# EAGLE schematic fpc_cable_all (EAGLE 9.6.2)
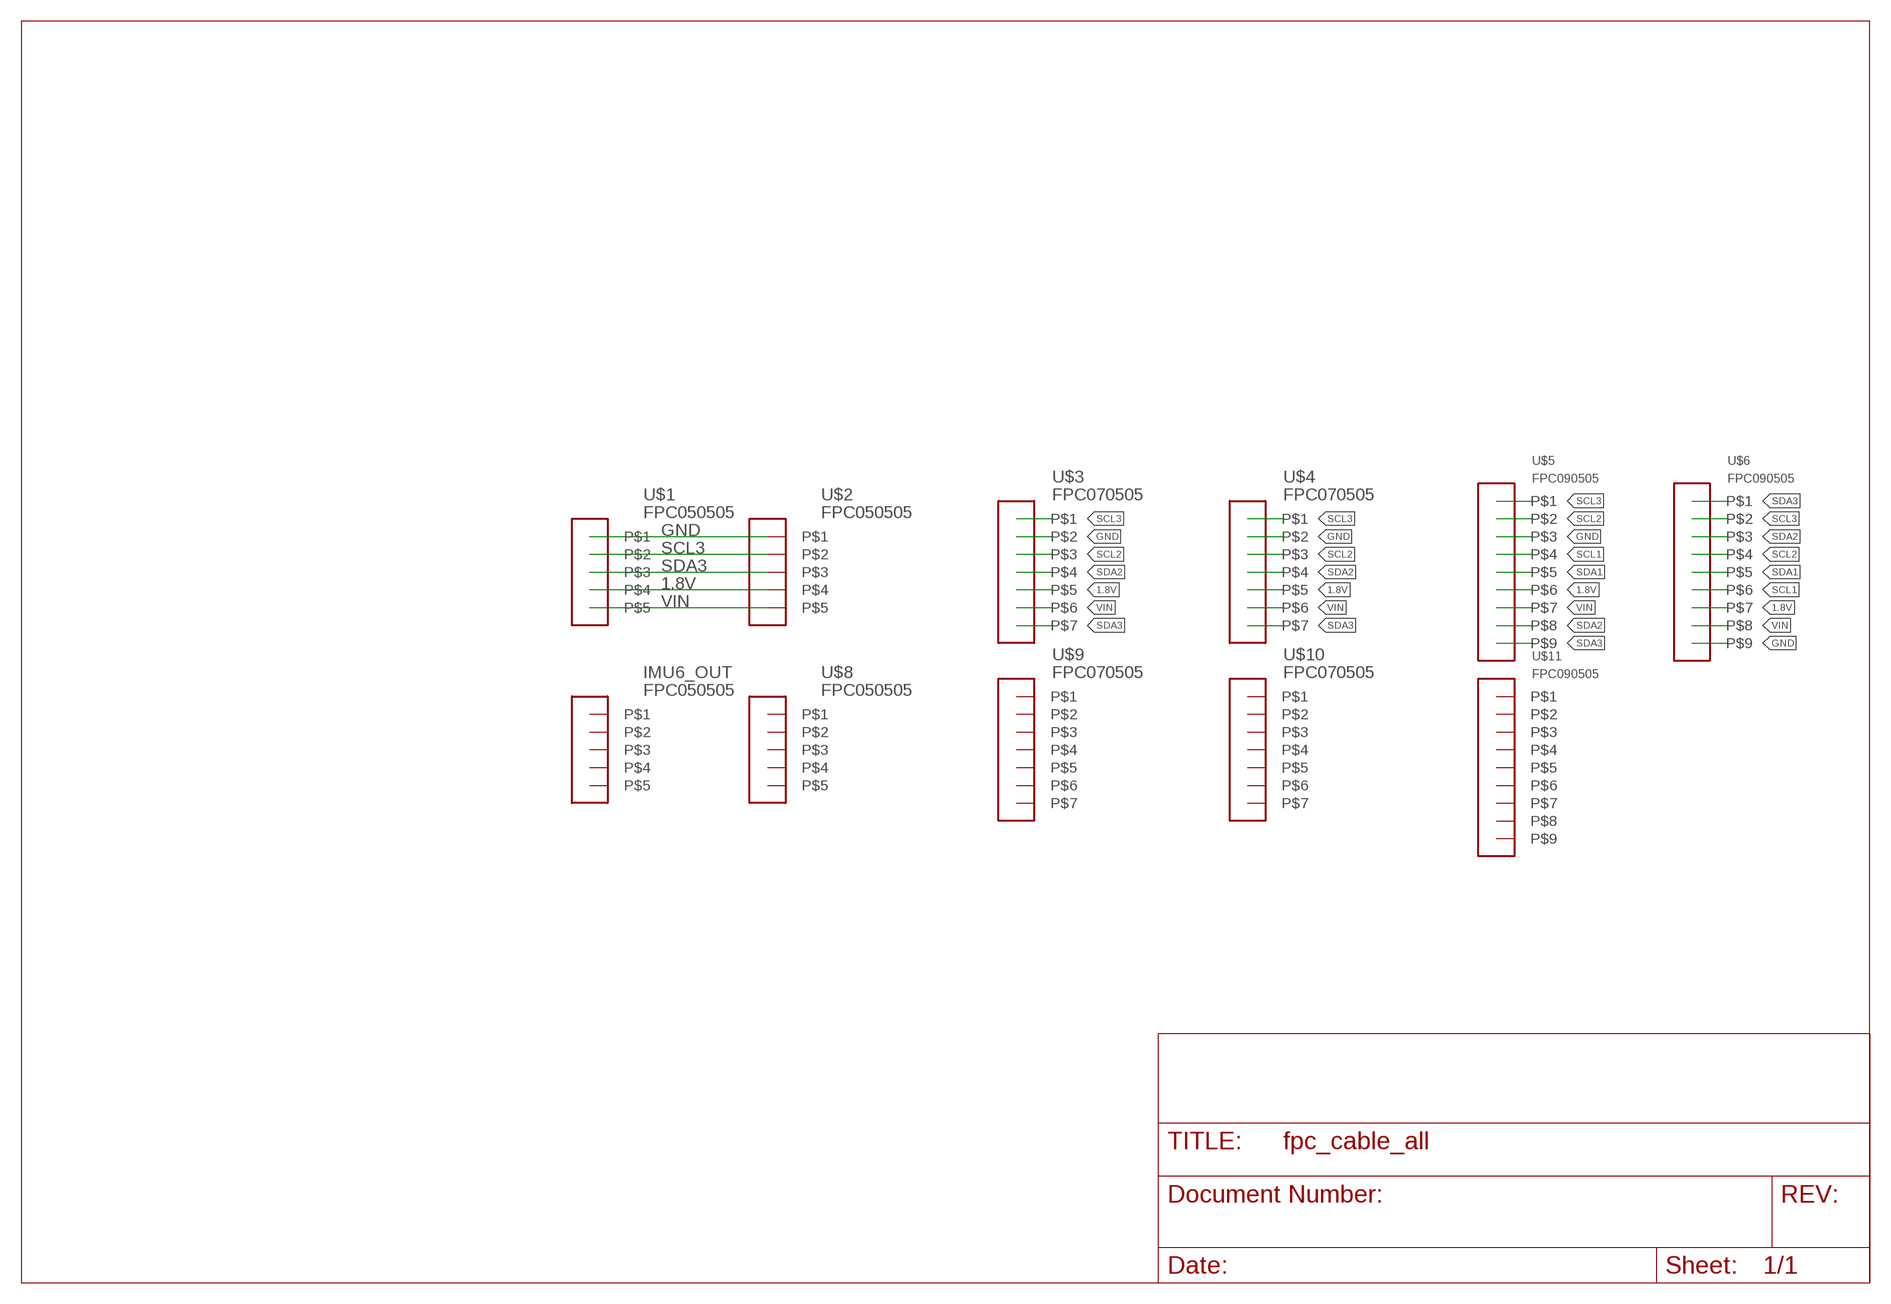
[diagram p0: schematic, sheet 1]

## Parts
IMU6_OUT  FPC050505  [FPC0505]
U$1  FPC050505  [FPC0505]
U$2  FPC050505  [FPC0505]
U$3  FPC070505  [FPC0705]
U$4  FPC070505  [FPC0705]
U$5  FPC090505  [FPC0905]
U$6  FPC090505  [FPC0905]
U$8  FPC050505  [FPC0505]
U$9  FPC070505  [FPC0705]
U$10  FPC070505  [FPC0705]
U$11  FPC090505  [FPC0905]

## Nets
1.8V: U$1.P$4 U$2.P$4 U$3.P$5 U$4.P$5 U$5.P$6 U$6.P$7
GND: U$1.P$1 U$2.P$1 U$3.P$2 U$4.P$2 U$5.P$3 U$6.P$9
SCL1: U$5.P$4 U$6.P$6
SCL2: U$3.P$3 U$4.P$3 U$5.P$2 U$6.P$4
SCL3: U$1.P$2 U$2.P$2 U$3.P$1 U$4.P$1 U$5.P$1 U$6.P$2
SDA1: U$5.P$5 U$6.P$5
SDA2: U$3.P$4 U$4.P$4 U$5.P$8 U$6.P$3
SDA3: U$1.P$3 U$2.P$3 U$3.P$7 U$4.P$7 U$5.P$9 U$6.P$1
VIN: U$1.P$5 U$2.P$5 U$3.P$6 U$4.P$6 U$5.P$7 U$6.P$8
Unconnected: IMU6_OUT.P$1 IMU6_OUT.P$2 IMU6_OUT.P$3 IMU6_OUT.P$4 IMU6_OUT.P$5 U$8.P$1 U$8.P$2 U$8.P$3 U$8.P$4 U$8.P$5 U$9.P$1 U$9.P$2 U$9.P$3 U$9.P$4 U$9.P$5 U$9.P$6 U$9.P$7 U$10.P$1 U$10.P$2 U$10.P$3 U$10.P$4 U$10.P$5 U$10.P$6 U$10.P$7 U$11.P$1 U$11.P$2 U$11.P$3 U$11.P$4 U$11.P$5 U$11.P$6 U$11.P$7 U$11.P$8 U$11.P$9

## Library data of the parts
IMU6_OUT U$1 U$2 U$8 = my_library:FPC0505
U$3 U$4 U$9 U$10 = my_library:FPC0705
U$5 U$6 U$11 = my_library:FPC0905